# Altium schematic sheet Connectors.SchDoc
size A4; Organization: ORGANIZATION; Address1: ADDRESS 1; Address2: ADDRESS 2; Address3: ADDRESS 3; Address4: ADDRESS 4; Revision: -; SheetNumber: 4; SheetTotal: 5; ENG_APP_DATE: --/--/--; DSN_APP_DATE: --/--/--; CHK_APP_DATE: --/--/--
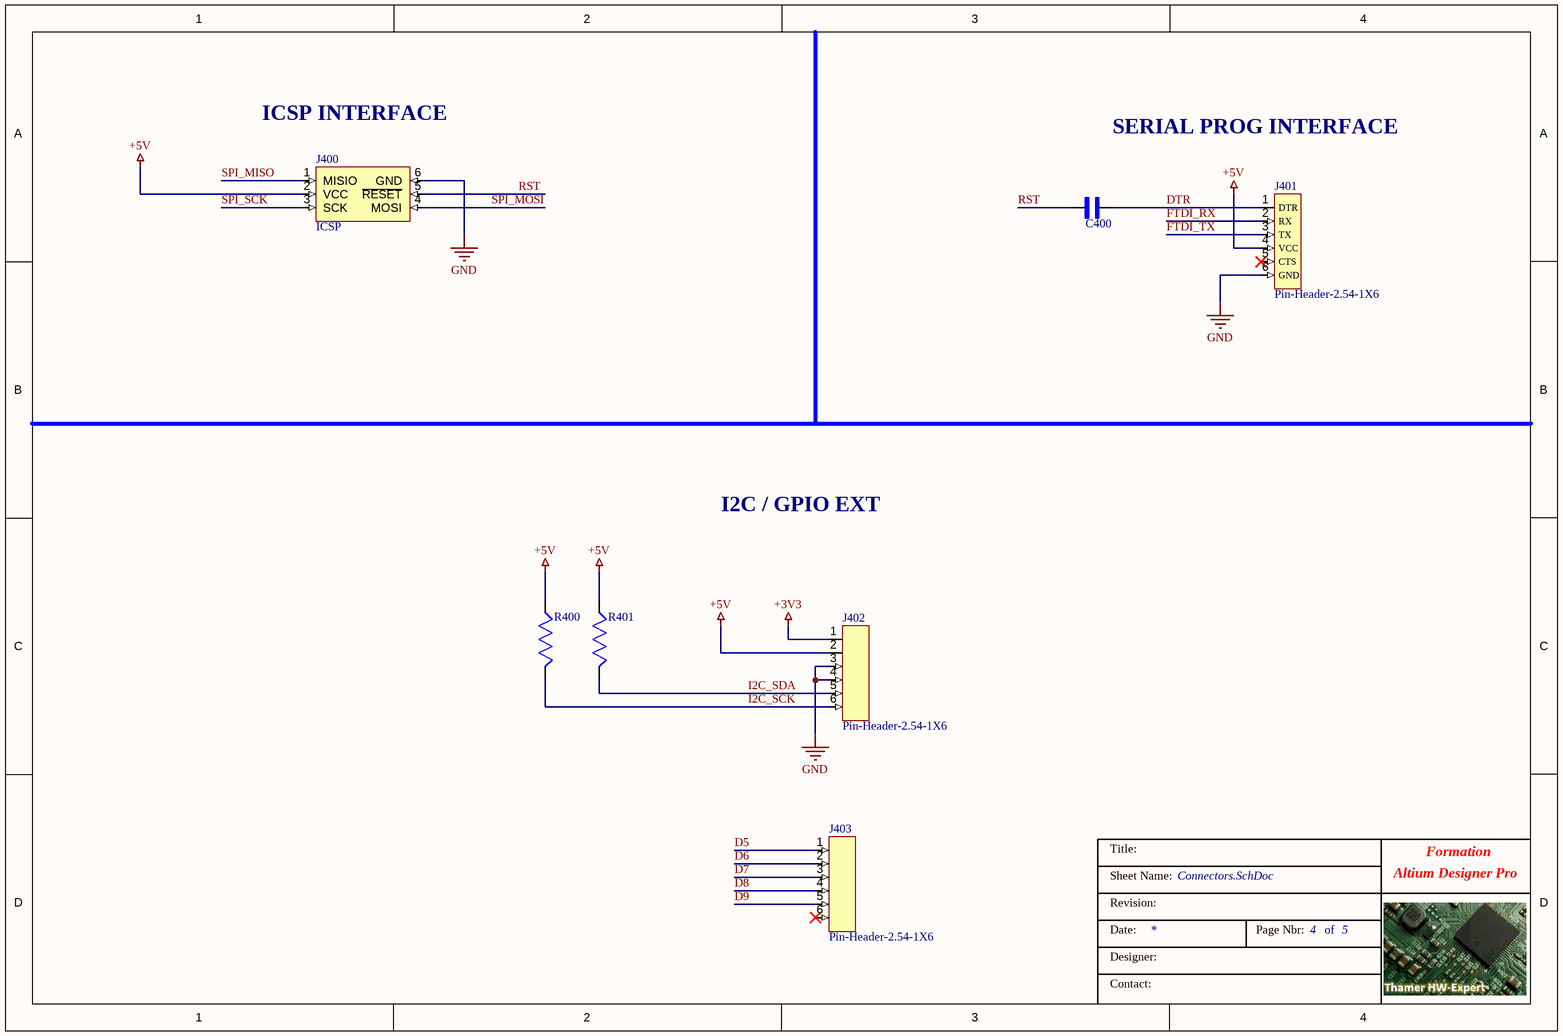
[diagram p0: Connectors.SchDoc]

## Parts
C400  GCM21BR71H104KA37K  [CAPC2012X135N]  (value not drawn)
J400  ICSP  [PINHEADER-3X2_2.54MM]
J401  Pin-Header-2.54-1X6  [PIN-HEADER-2.54MM-1X6]
J402  Pin-Header-2.54-1X6  [PIN-HEADER-2.54MM-1X6]
J403  Pin-Header-2.54-1X6  [PIN-HEADER-2.54MM-1X6]
R400  RC0805JR-134K7L  [RESC2012X60N]  (value not drawn)
R401  RC0805JR-134K7L  [RESC2012X60N]  (value not drawn)

## Nets
+3V3: J402.1
+5V: J400.2(VCC) J401.4(VCC) J402.2 R400.2 R401.2
GND: J400.6(GND) J401.6(GND) J402.3 J402.4
D5: J403.1
D6: J403.2
D7: J403.3
D8: J403.4
D9: J403.5
DTR: C400.2 J401.1(DTR)
FTDI_RX: J401.2(RX)
FTDI_TX: J401.3(TX)
I2C_SCK: J402.6 R400.1
I2C_SDA: J402.5 R401.1
RST: C400.1 J400.5(~{RESET})
SPI_MISO: J400.1(MISIO)
SPI_MOSI: J400.4(MOSI)
SPI_SCK: J400.3(SCK)

Not connected (* = marked no-connect by the designer): J401 5(CTS)*; J403 6*

## Notes on the sheet
- ICSP INTERFACE
- SERIAL PROG INTERFACE
- I2C / GPIO EXT
- Title:
- Formation
- Sheet Name:
- Revision:
- Altium Designer Pro
- Date:
- Designer:
- Contact:
- Page Nbr:
- of

## Library data of the parts
C400 = GCM21BR71H104KA37K: .1UF 50V 10% 080; MF: {'manufacturer': u'Murata'}; Package: None; Price: None; Value: *; MP: GCM21BR71H104KA37K; Availability: Unavailable
R400 R401 = RC0805JR-134K7L: MF: {'manufacturer': u'Yageo'}; Package: None; Price: None; Value: *; MP: RC0805JR-134K7L; Availability: Unavailable